# Altium schematic sheet Power Budget.SchDoc
size A4; DocumentNumber: 2; SheetNumber: 2; SheetTotal: 11
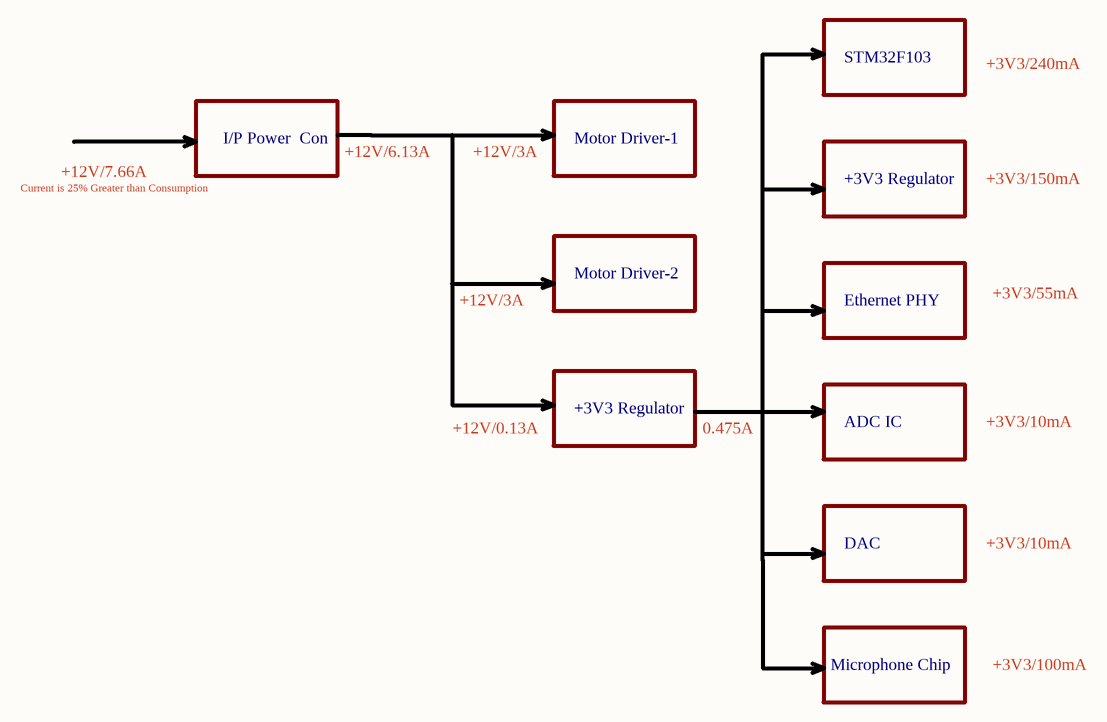
[diagram p0: Power Budget.SchDoc]

## Notes on the sheet
- STM32F103
- +3V3/240mA
- Current is 25% Greater than Consumption
- +12V/7.66A
- I/P Power  Con
- +12V/6.13A
- +12V/3A
- Motor Driver-1
- +3V3 Regulator
- +3V3/150mA
- Motor Driver-2
- Ethernet PHY
- +3V3/55mA
- +12V/0.13A
- 0.475A
- ADC IC
- +3V3/10mA
- DAC
- Microphone Chip
- +3V3/100mA